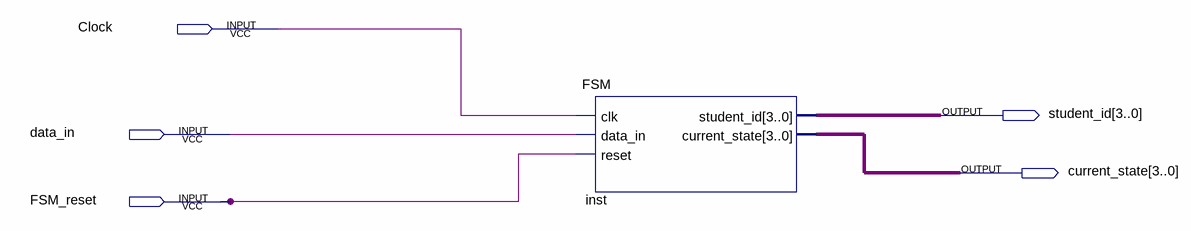
[diagram p0: schematic sheet]
// Quartus schematic FSMtest.bdf as structural Verilog: 1 symbols, 5 pins
module FSMtest (
  input  Clock,
  input  data_in,
  input  FSM_reset,
  output [3:0] student_id,
  output [3:0] current_state
);

  FSM inst (.clk(Clock), .data_in(data_in), .reset(FSM_reset), .student_id(student_id), .current_state(current_state));
endmodule
